# EAGLE design LM74670 ideal diode breakout (EAGLE 9.0.0)
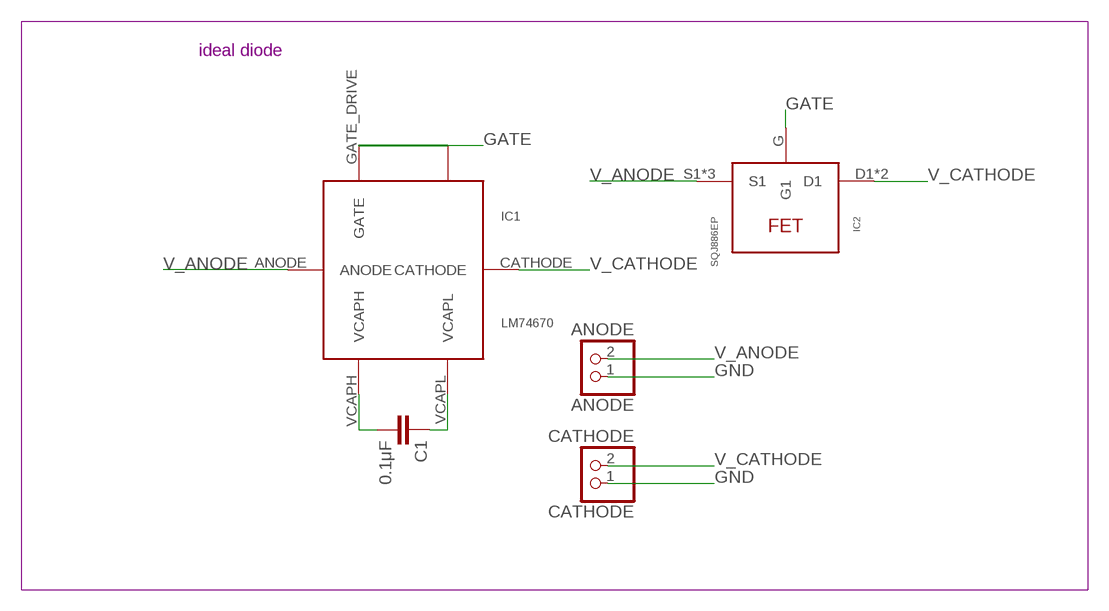
[diagram p0: schematic, sheet 1]

## Parts
ANODE  ANODE  PINHD-1X2  [1X02]
C1  0.1μF  C-EUC0805  [C0805]
CATHODE  CATHODE  PINHD-1X2  [1X02]
IC1  LM74670  [VSSOP-8]
IC2  SQJ886EP  [SO-8L]

## Nets
GATE: IC1.GATE_PULLD IC2.G(G1)
GND: ANODE.1 CATHODE.1
N$1: C1.2 IC1.VCAPH
N$2: C1.1 IC1.VCAPL
V_ANODE: ANODE.2 IC1.ANODE IC2.S1 IC2.S2(S1) IC2.S3(S1)
V_CATHODE: CATHODE.2 IC1.CATHODE IC2.D1 IC2.D2(D1)
Unconnected: IC1.GATE_DRIVE(GATE)

## Notes on the sheet
- ideal diode

## Library data of the parts
ANODE CATHODE = pinhead:PINHD-1X2: PIN HEADER
C1 = rcl:C-EU: CAPACITOR, European symbol; SPICEPREFIX: C
IC1 = LM74670 - Smart Diode Rectifier Controller:LM74670
IC2 = SQJ886EP - N-FET:SQJ886EP

## Net classes
0 GND: width 0.4 mm, drill 0.4 mm, clearance 0.1 mm

## Board
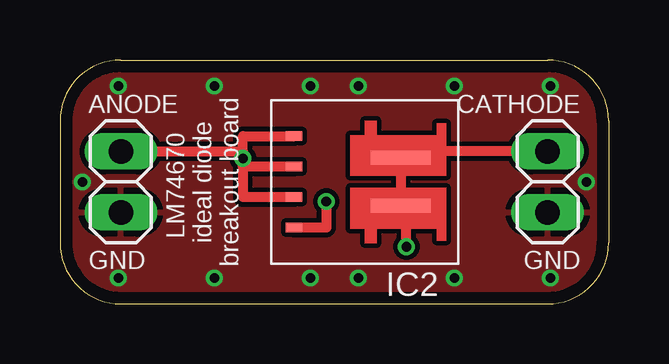
[diagram p1: board, top side]
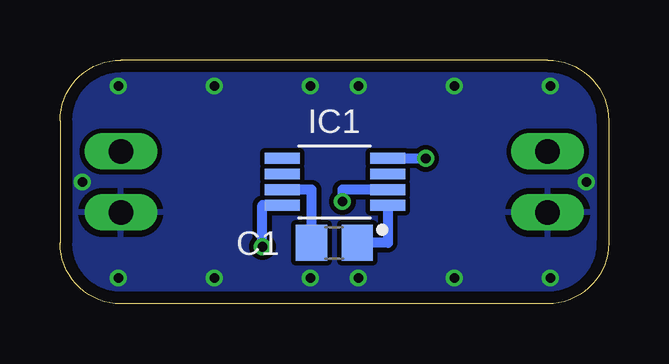
[diagram p2: board, bottom side, seen from below]

Size 22.86 x 10.16 mm. Coordinates in mm from the lower left corner, seen from the top.
Outline: 2.54,0 20.32,0 arc90 22.86,2.54 22.86,7.62 arc90 20.32,10.16 2.54,10.16 arc90 0,7.62 0,2.54 arc90 2.54,0
Copper layers (1*16): Top 0.035mm / dielectric 1.5mm / Bottom 0.035mm
Design rules "markovac_2layer": minimum track width 0.2mm, minimum drill 0.35mm, track to track 0.2mm, track to pad 0.2mm, pad to pad 0.2mm, via to via 0.2mm, smd to smd 0.2mm, copper to edge 0.5mm, drill to drill 8mil, minimum pad ring 0.15mm, minimum via ring 0.15mm, stop-mask expansion 4mil, vias tented up to drill 0.35mm, thermal gap 10mil

### Footprints (pad centres in the part's own frame; a part is rotated, then mirrored left to right if it is on the bottom)
1X02 = drill 1.016 long: 1 -1.27,0; 2 1.27,0
C0805 = smd 1.3 x 1.5: 1 -0.95,0; 2 0.95,0
VSSOP-8 = smd 0.45 x 1.45: ANODE 0.98,-2.23; CATHODE -0.97,2.17; GATE_DRIVE 0.33,2.17; GATE_PULLD -0.32,-2.23; NC1 0.33,-2.23; NC2 0.98,2.17; VCAPH -0.32,2.17; VCAPL -0.97,-2.23
SO-8L = smd 0.58 x 2.5: D1 -1,1.5; D2 1,1.5 | smd 0.4 x 0.7: G 1.9,-2.95; S1 -1.91,-2.95; S2 -0.64,-2.95; S3 0.63,-2.95

### Placement (x,y rotation side)
ANODE  2.54,5.08 90 top
C1  11.43,2.54 180 bottom
CATHODE  20.32,5.08 90 top
IC1  11.43,5.08 90 bottom
IC2  12.7,5.08 270 top

### Tracks (layer width: path | path; a pad name or v marks a point on that pad's centre or on a via)
GATE  (via drill 0.4)
  Top 0.406: v11.09,4.26 11.09,3.18 IC2.G
  Bottom 0.406: IC1.GATE_PULLD 11.09,4.76 v11.09,4.26
GND  (via drill 0.4)
  other vias: 0.93,5.08 21.93,5.08 2.43,9.08 20.43,9.08 20.43,1.08 2.43,1.08 6.43,9.08 6.43,1.08 16.43,9.08 16.43,1.08 10.43,9.08 12.43,9.08 10.43,1.08 12.43,1.08
  pour Bottom: -0.57,0.08 22.93,0.08 22.93,10.08 -0.57,10.08
  pour Top: -0.57,0.08 22.93,0.08 22.93,10.08 -0.57,10.08
N$1
  Bottom 0.406: C1.2 12.38,4.76 IC1.VCAPH
N$2
  Bottom 0.406: IC1.VCAPL 9.2,2.54 C1.1
V_ANODE  (via drill 0.4)
  Top 0.406: 7.62,6.35 7.62,6.99 IC2.S1 | 7.62,5.72 v7.62,6.06 7.62,6.35 | ANODE.2 7.62,6.35 | IC2.S3 7.62,4.45 7.62,5.72 | IC2.S2 7.62,5.72
  Bottom 0.406: IC1.ANODE v7.62,6.06
V_CATHODE  (via drill 0.4)
  Top 0.406: CATHODE.2 14.2,6.35 IC2.D1 IC2.D2 14.43,4.08 v14.43,2.38
  Bottom 0.406: v14.43,2.38 14.43,4.11 IC1.CATHODE

### Text on the board
tNames: LM74670 / ideal diode / breakout board | GND | GND